# Altium schematic sheet drivers_lvds.SchDoc: Drivers Lvds - HSMC
size A2; Author: Cassio Berni; DrawnBy: CCB; Revision: 1_02; SheetNumber: 1; SheetTotal: 1; PageSetup: Record=PageOptions|CenterHorizontal=True|CenterVertical=True|PrintScale=0.50|XCorrection=1.00|YCorrection=1.00|PrintKind=0|BorderSize=5000000|LeftOffset=0|BottomOffset=0|Orientation=2|PaperLength=1000|PaperWidth=1000|Scale=100|PaperSource=7|PrintQuality=-3|MediaType=1|DitherType=10|PrintScaleMode=1|PaperKind=A4|PaperIndex=9
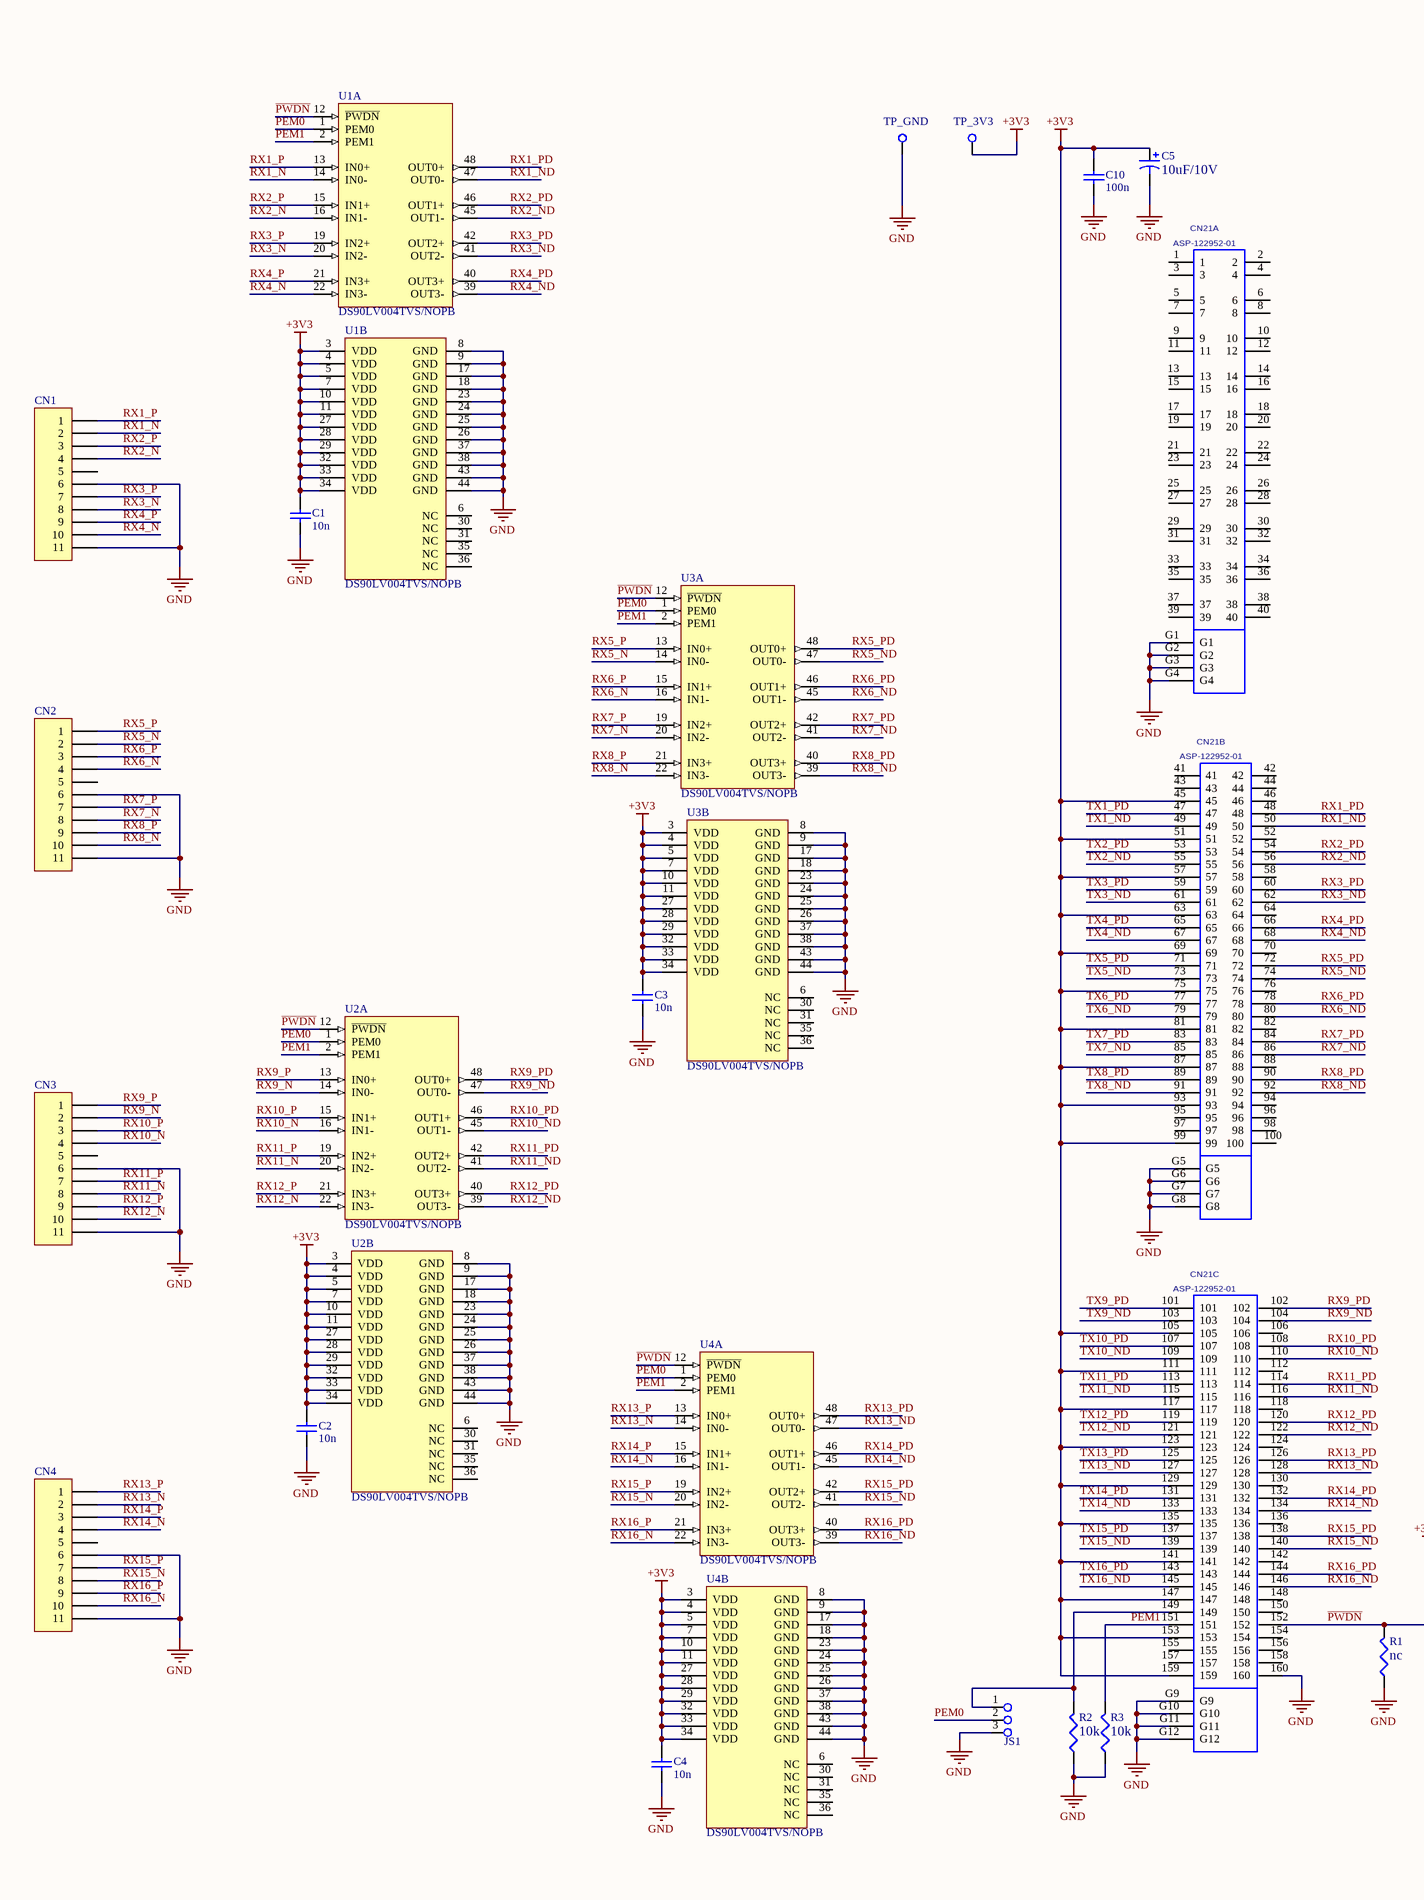
[diagram p0: drivers_lvds.SchDoc, left]
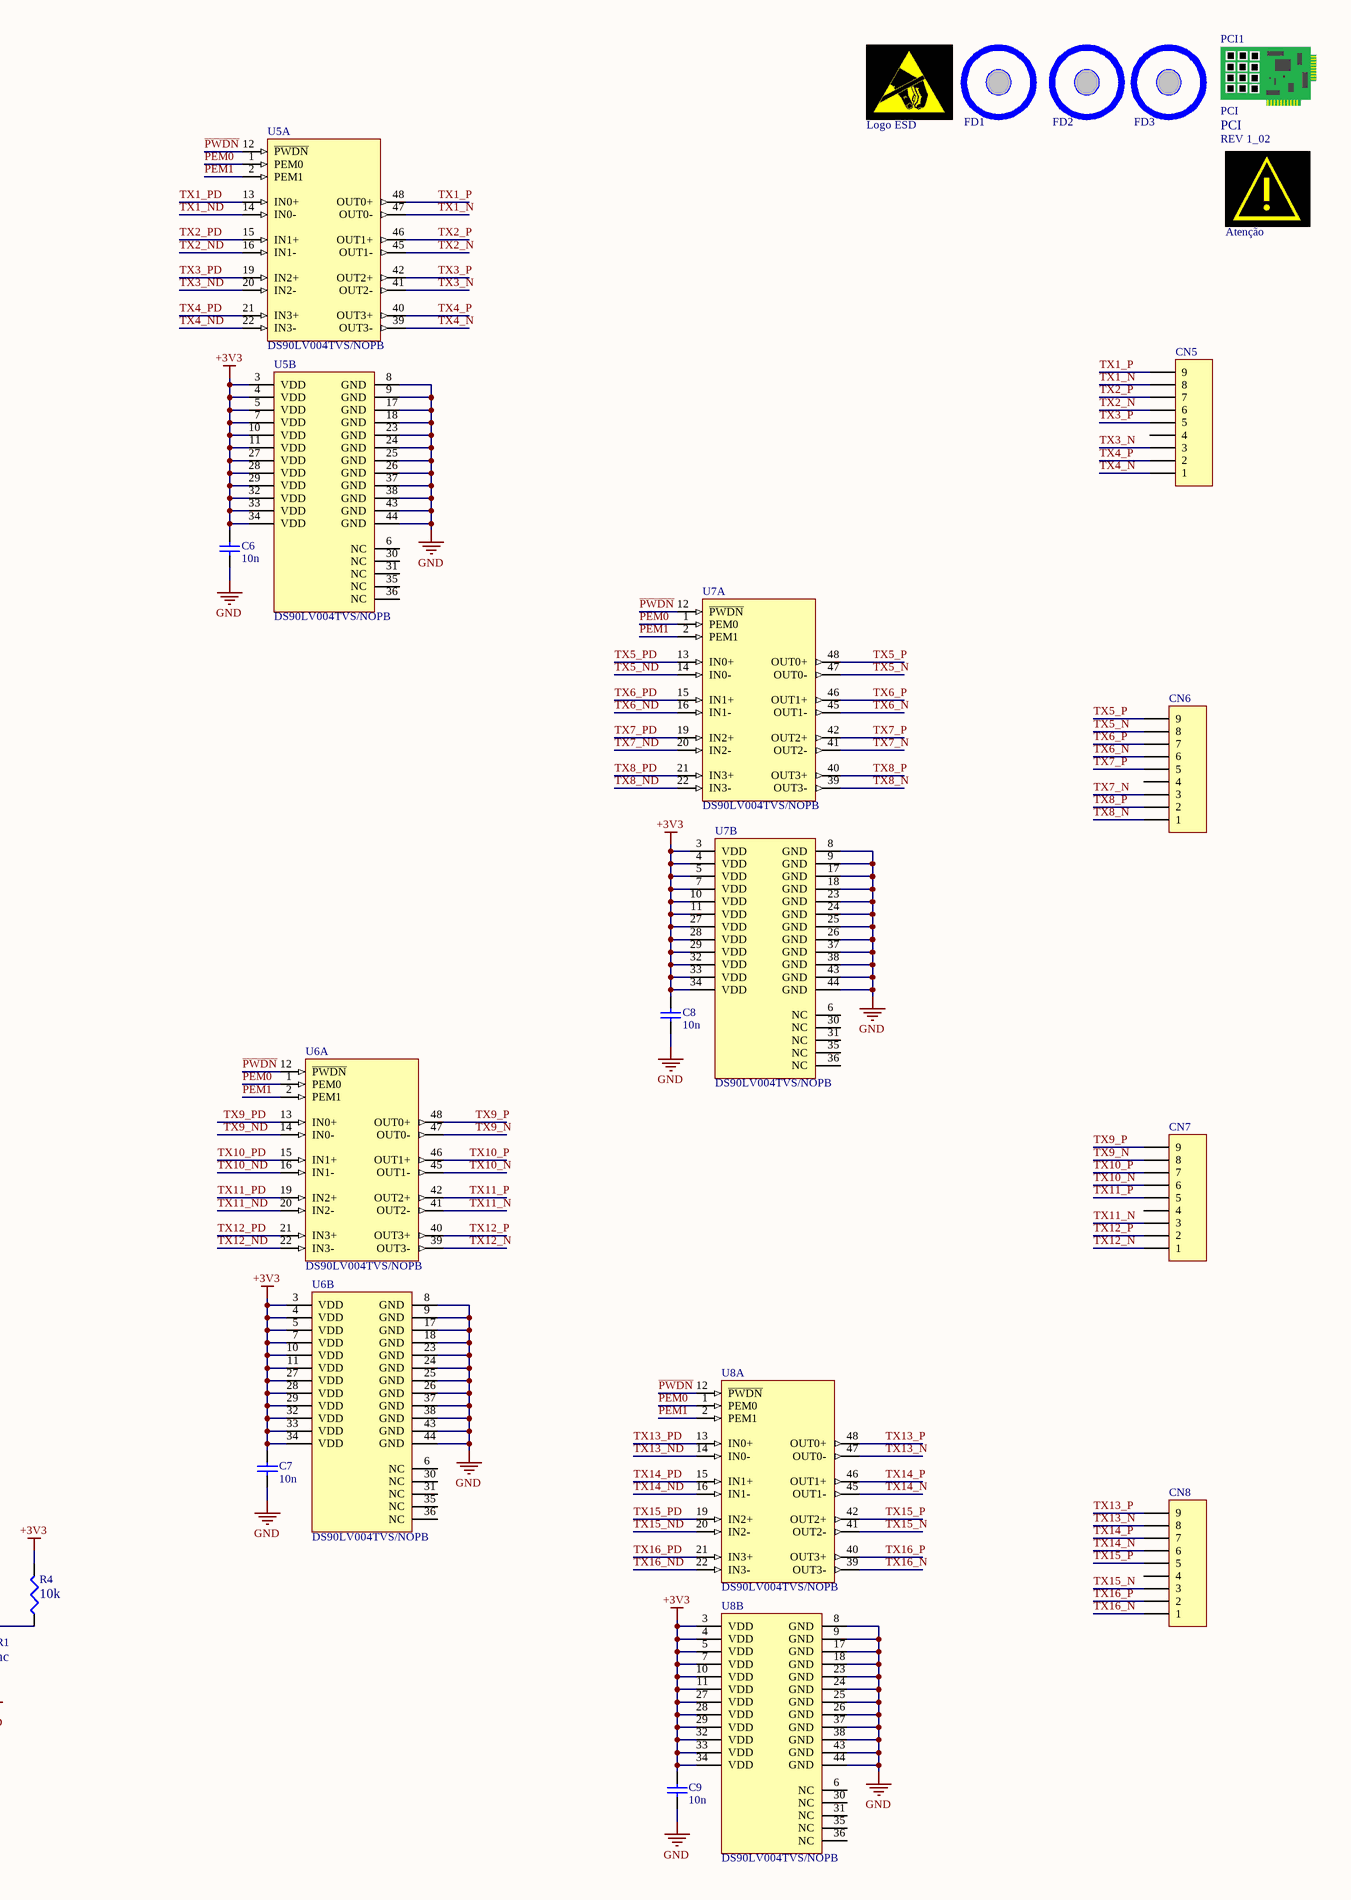
[diagram p1: drivers_lvds.SchDoc, right]

## Parts
AT3  Valor: Atenção  [LEIA_DOCUMENTACAO]  (hidden comment: ##nl)
C1  Valor: 10n  [0603 - CAP - montagem na maquina]  (hidden comment: Capacitor Cerâmico SMD)
C2  Valor: 10n  [0603 - CAP - montagem na maquina]  (hidden comment: Capacitor Cerâmico SMD)
C3  Valor: 10n  [0603 - CAP - montagem na maquina]  (hidden comment: Capacitor Cerâmico SMD)
C4  Valor: 10n  [0603 - CAP - montagem na maquina]  (hidden comment: Capacitor Cerâmico SMD)
C5  Valor: 10uF/10V  [CASE-B]  (hidden comment: Capacitor de tântalo)
C6  Valor: 10n  [0603 - CAP - montagem na maquina]  (hidden comment: Capacitor Cerâmico SMD)
C7  Valor: 10n  [0603 - CAP - montagem na maquina]  (hidden comment: Capacitor Cerâmico SMD)
C8  Valor: 10n  [0603 - CAP - montagem na maquina]  (hidden comment: Capacitor Cerâmico SMD)
C9  Valor: 10n  [0603 - CAP - montagem na maquina]  (hidden comment: Capacitor Cerâmico SMD)
C10  Valor: 100n  [0603 - CAP - montagem na maquina]  (hidden comment: Capacitor Cerâmico SMD)
CN1  MHDR1X11  [MHDR1X11_Axonn]  (value not drawn)
CN2  MHDR1X11  [MHDR1X11_Axonn]  (value not drawn)
CN3  MHDR1X11  [MHDR1X11_Axonn]  (value not drawn)
CN4  MHDR1X11  [MHDR1X11_Axonn]  (value not drawn)
CN5  MHDR1X9  [MHDR1X9_Axonn]  (value not drawn)
CN6  MHDR1X9  [MHDR1X9_Axonn]  (value not drawn)
CN7  MHDR1X9  [MHDR1X9_Axonn]  (value not drawn)
CN8  MHDR1X9  [MHDR1X9_Axonn]  (value not drawn)
CN21  ASP-122952-01  [ASP-122952-01]  (parts A,B,C of 3)
ESD2  Valor: Logo ESD  [ESTATICA]  (hidden comment: ##nl)
FD1  ##nl  [FIDUCIAL]  (value not drawn)
FD2  ##nl  [FIDUCIAL]  (value not drawn)
FD3  ##nl  [FIDUCIAL]  (value not drawn)
JS1  ##Obs  [Jumper de solda 3 vias]  (value not drawn)
PCI1  PCI  Rev: REV 1_02
R1  Valor: nc  [0603 - MONTAGEM MÁQUINA]  (hidden comment: Res3)
R2  Valor: 10k  [0603 - MONTAGEM MÁQUINA]  (hidden comment: Res3)
R3  Valor: 10k  [0603 - MONTAGEM MÁQUINA]  (hidden comment: Res3)
R4  Valor: 10k  [0603 - MONTAGEM MÁQUINA]  (hidden comment: Res3)
TP_3V3  Comment  [Testpoint]  (value not drawn)
TP_GND  Comment  [Testpoint]  (value not drawn)
U1  DS90LV004TVS/NOPB  [VBC48A_N]  (parts A,B of 2)
U2  DS90LV004TVS/NOPB  [VBC48A_N]  (parts A,B of 2)
U3  DS90LV004TVS/NOPB  [VBC48A_N]  (parts A,B of 2)
U4  DS90LV004TVS/NOPB  [VBC48A_N]  (parts A,B of 2)
U5  DS90LV004TVS/NOPB  [VBC48A_N]  (parts A,B of 2)
U6  DS90LV004TVS/NOPB  [VBC48A_N]  (parts A,B of 2)
U7  DS90LV004TVS/NOPB  [VBC48A_N]  (parts A,B of 2)
U8  DS90LV004TVS/NOPB  [VBC48A_N]  (parts A,B of 2)

## Nets
+3V3: C1.2 C2.2 C3.2 C4.2 C5.1 C6.2 C7.2 C8.2 C9.2 C10.2 CN21.45 CN21.51 CN21.57 CN21.63 CN21.69 CN21.75 CN21.81 CN21.87 CN21.93 CN21.99 CN21.105 CN21.111 CN21.117 CN21.123 CN21.129 CN21.135 CN21.141 CN21.147 CN21.153 CN21.159 R4.2 TP_3V3.1 U1.3(VDD) U1.4(VDD) U1.5(VDD) U1.7(VDD) U1.10(VDD) U1.11(VDD) U1.27(VDD) U1.28(VDD) U1.29(VDD) U1.32(VDD) U1.33(VDD) U1.34(VDD) U2.3(VDD) U2.4(VDD) U2.5(VDD) U2.7(VDD) U2.10(VDD) U2.11(VDD) U2.27(VDD) U2.28(VDD) U2.29(VDD) U2.32(VDD) U2.33(VDD) U2.34(VDD) U3.3(VDD) U3.4(VDD) U3.5(VDD) U3.7(VDD) U3.10(VDD) U3.11(VDD) U3.27(VDD) U3.28(VDD) U3.29(VDD) U3.32(VDD) U3.33(VDD) U3.34(VDD) U4.3(VDD) U4.4(VDD) U4.5(VDD) U4.7(VDD) U4.10(VDD) U4.11(VDD) U4.27(VDD) U4.28(VDD) U4.29(VDD) U4.32(VDD) U4.33(VDD) U4.34(VDD) U5.3(VDD) U5.4(VDD) U5.5(VDD) U5.7(VDD) U5.10(VDD) U5.11(VDD) U5.27(VDD) U5.28(VDD) U5.29(VDD) U5.32(VDD) U5.33(VDD) U5.34(VDD) U6.3(VDD) U6.4(VDD) U6.5(VDD) U6.7(VDD) U6.10(VDD) U6.11(VDD) U6.27(VDD) U6.28(VDD) U6.29(VDD) U6.32(VDD) U6.33(VDD) U6.34(VDD) U7.3(VDD) U7.4(VDD) U7.5(VDD) U7.7(VDD) U7.10(VDD) U7.11(VDD) U7.27(VDD) U7.28(VDD) U7.29(VDD) U7.32(VDD) U7.33(VDD) U7.34(VDD) U8.3(VDD) U8.4(VDD) U8.5(VDD) U8.7(VDD) U8.10(VDD) U8.11(VDD) U8.27(VDD) U8.28(VDD) U8.29(VDD) U8.32(VDD) U8.33(VDD) U8.34(VDD)
GND: C1.1 C2.1 C3.1 C4.1 C5.2 C6.1 C7.1 C8.1 C9.1 C10.1 CN1.6 CN1.11 CN2.6 CN2.11 CN3.6 CN3.11 CN4.6 CN4.11 CN21.160 CN21.G1 CN21.G2 CN21.G3 CN21.G4 CN21.G5 CN21.G6 CN21.G7 CN21.G8 CN21.G9 CN21.G10 CN21.G11 CN21.G12 JS1.3 R1.1 R2.1 R3.1 TP_GND.1 U1.8(GND) U1.9(GND) U1.17(GND) U1.18(GND) U1.23(GND) U1.24(GND) U1.25(GND) U1.26(GND) U1.37(GND) U1.38(GND) U1.43(GND) U1.44(GND) U2.8(GND) U2.9(GND) U2.17(GND) U2.18(GND) U2.23(GND) U2.24(GND) U2.25(GND) U2.26(GND) U2.37(GND) U2.38(GND) U2.43(GND) U2.44(GND) U3.8(GND) U3.9(GND) U3.17(GND) U3.18(GND) U3.23(GND) U3.24(GND) U3.25(GND) U3.26(GND) U3.37(GND) U3.38(GND) U3.43(GND) U3.44(GND) U4.8(GND) U4.9(GND) U4.17(GND) U4.18(GND) U4.23(GND) U4.24(GND) U4.25(GND) U4.26(GND) U4.37(GND) U4.38(GND) U4.43(GND) U4.44(GND) U5.8(GND) U5.9(GND) U5.17(GND) U5.18(GND) U5.23(GND) U5.24(GND) U5.25(GND) U5.26(GND) U5.37(GND) U5.38(GND) U5.43(GND) U5.44(GND) U6.8(GND) U6.9(GND) U6.17(GND) U6.18(GND) U6.23(GND) U6.24(GND) U6.25(GND) U6.26(GND) U6.37(GND) U6.38(GND) U6.43(GND) U6.44(GND) U7.8(GND) U7.9(GND) U7.17(GND) U7.18(GND) U7.23(GND) U7.24(GND) U7.25(GND) U7.26(GND) U7.37(GND) U7.38(GND) U7.43(GND) U7.44(GND) U8.8(GND) U8.9(GND) U8.17(GND) U8.18(GND) U8.23(GND) U8.24(GND) U8.25(GND) U8.26(GND) U8.37(GND) U8.38(GND) U8.43(GND) U8.44(GND)
~{PWDN}: CN21.152 R1.2 R4.1 U1.12(~{PWDN}) U2.12(~{PWDN}) U3.12(~{PWDN}) U4.12(~{PWDN}) U5.12(~{PWDN}) U6.12(~{PWDN}) U7.12(~{PWDN}) U8.12(~{PWDN})
PEM0: JS1.2 U1.1(PEM0) U2.1(PEM0) U3.1(PEM0) U4.1(PEM0) U5.1(PEM0) U6.1(PEM0) U7.1(PEM0) U8.1(PEM0)
PEM1: CN21.151 R3.2 U1.2(PEM1) U2.2(PEM1) U3.2(PEM1) U4.2(PEM1) U5.2(PEM1) U6.2(PEM1) U7.2(PEM1) U8.2(PEM1)
RX1_N: CN1.2 U1.14(IN0-)
RX1_ND: CN21.50 U1.47(OUT0-)
RX1_P: CN1.1 U1.13(IN0+)
RX1_PD: CN21.48 U1.48(OUT0+)
RX2_N: CN1.4 U1.16(IN1-)
RX2_ND: CN21.56 U1.45(OUT1-)
RX2_P: CN1.3 U1.15(IN1+)
RX2_PD: CN21.54 U1.46(OUT1+)
RX3_N: CN1.8 U1.20(IN2-)
RX3_ND: CN21.62 U1.41(OUT2-)
RX3_P: CN1.7 U1.19(IN2+)
RX3_PD: CN21.60 U1.42(OUT2+)
RX4_N: CN1.10 U1.22(IN3-)
RX4_ND: CN21.68 U1.39(OUT3-)
RX4_P: CN1.9 U1.21(IN3+)
RX4_PD: CN21.66 U1.40(OUT3+)
RX5_N: CN2.2 U3.14(IN0-)
RX5_ND: CN21.74 U3.47(OUT0-)
RX5_P: CN2.1 U3.13(IN0+)
RX5_PD: CN21.72 U3.48(OUT0+)
RX6_N: CN2.4 U3.16(IN1-)
RX6_ND: CN21.80 U3.45(OUT1-)
RX6_P: CN2.3 U3.15(IN1+)
RX6_PD: CN21.78 U3.46(OUT1+)
RX7_N: CN2.8 U3.20(IN2-)
RX7_ND: CN21.86 U3.41(OUT2-)
RX7_P: CN2.7 U3.19(IN2+)
RX7_PD: CN21.84 U3.42(OUT2+)
RX8_N: CN2.10 U3.22(IN3-)
RX8_ND: CN21.92 U3.39(OUT3-)
RX8_P: CN2.9 U3.21(IN3+)
RX8_PD: CN21.90 U3.40(OUT3+)
RX9_N: CN3.2 U2.14(IN0-)
RX9_ND: CN21.104 U2.47(OUT0-)
RX9_P: CN3.1 U2.13(IN0+)
RX9_PD: CN21.102 U2.48(OUT0+)
RX10_N: CN3.4 U2.16(IN1-)
RX10_ND: CN21.110 U2.45(OUT1-)
RX10_P: CN3.3 U2.15(IN1+)
RX10_PD: CN21.108 U2.46(OUT1+)
RX11_N: CN3.8 U2.20(IN2-)
RX11_ND: CN21.116 U2.41(OUT2-)
RX11_P: CN3.7 U2.19(IN2+)
RX11_PD: CN21.114 U2.42(OUT2+)
RX12_N: CN3.10 U2.22(IN3-)
RX12_ND: CN21.122 U2.39(OUT3-)
RX12_P: CN3.9 U2.21(IN3+)
RX12_PD: CN21.120 U2.40(OUT3+)
RX13_N: CN4.2 U4.14(IN0-)
RX13_ND: CN21.128 U4.47(OUT0-)
RX13_P: CN4.1 U4.13(IN0+)
RX13_PD: CN21.126 U4.48(OUT0+)
RX14_N: CN4.4 U4.16(IN1-)
RX14_ND: CN21.134 U4.45(OUT1-)
RX14_P: CN4.3 U4.15(IN1+)
RX14_PD: CN21.132 U4.46(OUT1+)
RX15_N: CN4.8 U4.20(IN2-)
RX15_ND: CN21.140 U4.41(OUT2-)
RX15_P: CN4.7 U4.19(IN2+)
RX15_PD: CN21.138 U4.42(OUT2+)
RX16_N: CN4.10 U4.22(IN3-)
RX16_ND: CN21.146 U4.39(OUT3-)
RX16_P: CN4.9 U4.21(IN3+)
RX16_PD: CN21.144 U4.40(OUT3+)
TX1_N: CN5.8 U5.47(OUT0-)
TX1_ND: CN21.49 U5.14(IN0-)
TX1_P: CN5.9 U5.48(OUT0+)
TX1_PD: CN21.47 U5.13(IN0+)
TX2_N: CN5.6 U5.45(OUT1-)
TX2_ND: CN21.55 U5.16(IN1-)
TX2_P: CN5.7 U5.46(OUT1+)
TX2_PD: CN21.53 U5.15(IN1+)
TX3_N: CN5.3 U5.41(OUT2-)
TX3_ND: CN21.61 U5.20(IN2-)
TX3_P: CN5.5 U5.42(OUT2+)
TX3_PD: CN21.59 U5.19(IN2+)
TX4_N: CN5.1 U5.39(OUT3-)
TX4_ND: CN21.67 U5.22(IN3-)
TX4_P: CN5.2 U5.40(OUT3+)
TX4_PD: CN21.65 U5.21(IN3+)
TX5_N: CN6.8 U7.47(OUT0-)
TX5_ND: CN21.73 U7.14(IN0-)
TX5_P: CN6.9 U7.48(OUT0+)
TX5_PD: CN21.71 U7.13(IN0+)
TX6_N: CN6.6 U7.45(OUT1-)
TX6_ND: CN21.79 U7.16(IN1-)
TX6_P: CN6.7 U7.46(OUT1+)
TX6_PD: CN21.77 U7.15(IN1+)
TX7_N: CN6.3 U7.41(OUT2-)
TX7_ND: CN21.85 U7.20(IN2-)
TX7_P: CN6.5 U7.42(OUT2+)
TX7_PD: CN21.83 U7.19(IN2+)
TX8_N: CN6.1 U7.39(OUT3-)
TX8_ND: CN21.91 U7.22(IN3-)
TX8_P: CN6.2 U7.40(OUT3+)
TX8_PD: CN21.89 U7.21(IN3+)
TX9_N: CN7.8 U6.47(OUT0-)
TX9_ND: CN21.103 U6.14(IN0-)
TX9_P: CN7.9 U6.48(OUT0+)
TX9_PD: CN21.101 U6.13(IN0+)
TX10_N: CN7.6 U6.45(OUT1-)
TX10_ND: CN21.109 U6.16(IN1-)
TX10_P: CN7.7 U6.46(OUT1+)
TX10_PD: CN21.107 U6.15(IN1+)
TX11_N: CN7.3 U6.41(OUT2-)
TX11_ND: CN21.115 U6.20(IN2-)
TX11_P: CN7.5 U6.42(OUT2+)
TX11_PD: CN21.113 U6.19(IN2+)
TX12_N: CN7.1 U6.39(OUT3-)
TX12_ND: CN21.121 U6.22(IN3-)
TX12_P: CN7.2 U6.40(OUT3+)
TX12_PD: CN21.119 U6.21(IN3+)
TX13_N: CN8.8 U8.47(OUT0-)
TX13_ND: CN21.127 U8.14(IN0-)
TX13_P: CN8.9 U8.48(OUT0+)
TX13_PD: CN21.125 U8.13(IN0+)
TX14_N: CN8.6 U8.45(OUT1-)
TX14_ND: CN21.133 U8.16(IN1-)
TX14_P: CN8.7 U8.46(OUT1+)
TX14_PD: CN21.131 U8.15(IN1+)
TX15_N: CN8.3 U8.41(OUT2-)
TX15_ND: CN21.139 U8.20(IN2-)
TX15_P: CN8.5 U8.42(OUT2+)
TX15_PD: CN21.137 U8.19(IN2+)
TX16_N: CN8.1 U8.39(OUT3-)
TX16_ND: CN21.145 U8.22(IN3-)
TX16_P: CN8.2 U8.40(OUT3+)
TX16_PD: CN21.143 U8.21(IN3+)
NetCN21_149: CN21.149 JS1.1 R2.2

Not connected (* = marked no-connect by the designer): CN1 5; CN2 5; CN3 5; CN4 5; CN5 4; CN6 4; CN7 4; CN8 4; CN21 1 2 3 4 5 6 7 8 9 10 11 12 13 14 15 16 17 18 19 20 21 22 23 24 25 26 27 28 29 30 31 32 33 34 35 36 37 38 39 40 41 42 43 44 46 52 58 64 70 76 82 88 94 95 96 97 98 100 106 112 118 124 130 136 142 148 150 154 155 156 157 158; U1 6(NC) 30(NC) 31(NC) 35(NC) 36(NC); U2 6(NC) 30(NC) 31(NC) 35(NC) 36(NC); U3 6(NC) 30(NC) 31(NC) 35(NC) 36(NC); U4 6(NC) 30(NC) 31(NC) 35(NC) 36(NC); U5 6(NC) 30(NC) 31(NC) 35(NC) 36(NC); U6 6(NC) 30(NC) 31(NC) 35(NC) 36(NC); U7 6(NC) 30(NC) 31(NC) 35(NC) 36(NC); U8 6(NC) 30(NC) 31(NC) 35(NC) 36(NC)

## Library data of the parts
AT3 = ATENCAO
C5 = Capacitor de tântalo: Grupo: 02
CN1-CN4 = MHDR1X11: Header, 11-Pin; LatestRevisionDate: 17-Jul-2002; LatestRevisionNote: Re-released for DXP Platform.; Publisher: Altium Limited
CN5-CN8 = MHDR1X9: Header, 9-Pin; LatestRevisionDate: 17-Jul-2002; LatestRevisionNote: Re-released for DXP Platform.; Publisher: Altium Limited
CN21 = ASP-122952-01: 0.5MM PITCH DOUBLE ROW HS TERMINAL ASSEMBLY; MANUFACTURER: SAMTEC; CREATED: May 29, 2015 - Wendy Xin; PCB DECAL: ASP-122952-01
ESD2 = ESD
FD1-FD3 = Fiducial: Valor: *
JS1 = JUMPER SOLDA 3 VIAS: JUMPER DE SOLDA 3 VIAS
R1-R4 = Res3: Resistor; Grupo: 01
TP_3V3 TP_GND = TESTPOINT
U1-U8 = DS90LV004TVS/NOPB: 4-Channel LVDS Buffer/Repeaters with Pre-Emphasis, 48-pin TQFP, Pb-Free; Manufacturer: National Semiconductor; PackageTopMarking: NSUZXYTT*DS90LV*004TVS; PowerWise: N; CompType: Interface IC; Published: 1-Mar-2010; DatasheetVersion: Mar-2009; PackageVersion: revA, Apr-2000; PackageReference: VBC48A; Publisher: Altium Limited; PackageDescription: TQFP, Jedec Metric, 7 x 7 x 1mm, 48 Lead, 0.5mm Pitch; Supplier 1: Digi-Key; Supplier Part Number 1: DS90LV004TVS-ND; Supplier 2: Farnell; Supplier Part Number 2: 1286736; PartNumber: DS90LV004TVS/NOPB; RoHS: Y; PinCount: 48; Code_JEDEC: MS-026-ABC; ComponentLink1Description: DS90LV004 Datasheet; ComponentLink1URL: http://www.national.com/ds/DS/DS90LV004.pdf; ComponentLink2Description: DS90LV004 Web Page; ComponentLink2URL: http://www.national.com/pf/DS/DS90LV004.html; ComponentLink3Description: VBC48A Package Page; ComponentLink3URL: http://www.national.com/packaging/folders/vbc48a.html
PCI1 = PCI: Valor: PCI